# Altium project Flex_Bridge_SW.PrjPcb
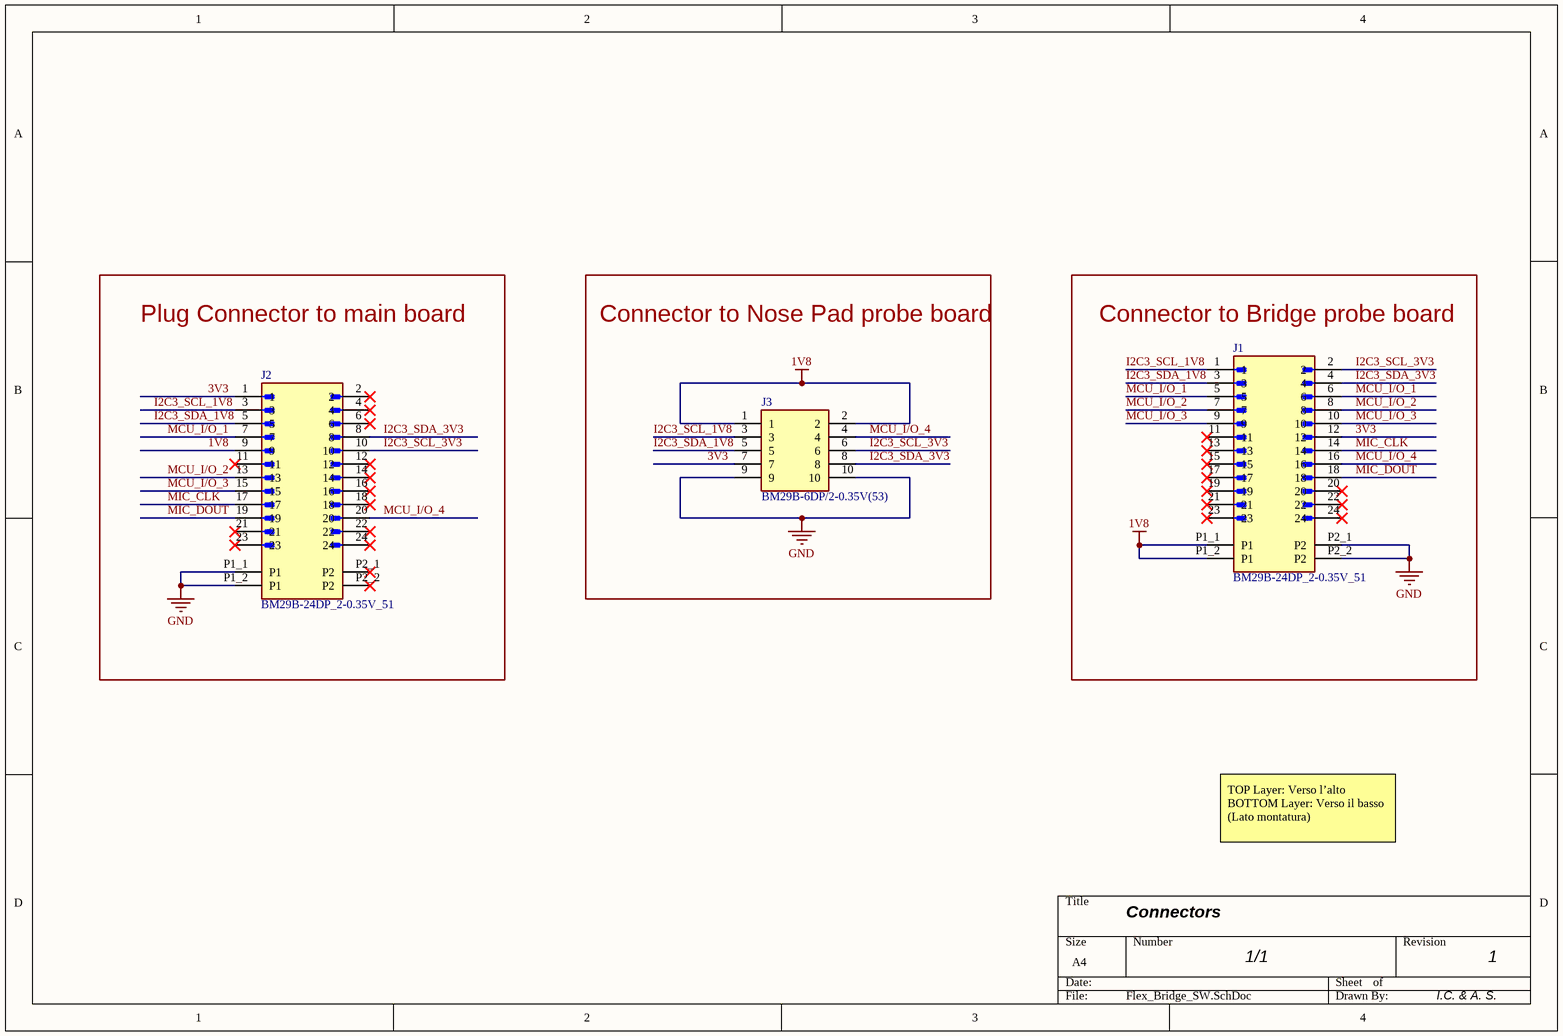
[diagram p0: Flex_Bridge_SW.SchDoc]
1 sheet, 3 parts. Net scope: global (net labels, ports and power ports of the same name join across sheets).
Board files: Flex_Bridge_SW.PcbDoc, Flex_Bridge_SW_panel.PcbDoc

## Sheet Flex_Bridge_SW.SchDoc
size A4; SheetNumber: 1; SheetTotal: 1

### Parts
J1  BM29B-24DP_2-0.35V_51  [New footprint 1]
J2  BM29B-24DP_2-0.35V_51  [New footprint 1]
J3  BM29B-6DP/2-0.35V(53)  [BM29B-6DP_2-0.35V(53)-Footprint-1]

### Blocks framed on the sheet
Plug Connector to main board: J2
Connector to Nose Pad probe board: J3
Connector to Bridge probe board: J1

### Nets
1V8: J1.P1_1(P1) J1.P1_2(P1) J2.9 J3.1 J3.2
GND: J1.P2_1(P2) J1.P2_2(P2) J2.P1_1(P1) J2.P1_2(P1) J3.9 J3.10
3V3: J1.12 J2.1 J3.7
I2C3_SCL_1V8: J1.1 J2.3 J3.3
I2C3_SCL_3V3: J1.2 J2.10 J3.6
I2C3_SDA_1V8: J1.3 J2.5 J3.5
I2C3_SDA_3V3: J1.4 J2.8 J3.8
MCU_I/O_1: J1.5 J1.6 J2.7
MCU_I/O_2: J1.7 J1.8 J2.13
MCU_I/O_3: J1.9 J1.10 J2.15
MCU_I/O_4: J1.16 J2.20 J3.4
MIC_CLK: J1.14 J2.17
MIC_DOUT: J1.18 J2.19

Not connected (* = marked no-connect by the designer): J1 11* 13* 15* 17* 19* 20* 21* 22* 23* 24*; J2 2* 4* 6* 11* 12* 14* 16* 18* 21* 22* 23* 24* P2_1(P2)* P2_2(P2)*

### Notes on the sheet
- TOP Layer: Verso l’alto
  BOTTOM Layer: Verso il basso (Lato montatura)
- Connectors
- 1/1
- 1
- I.C. & A. S.

### Library data of the parts
J1 J2 = CMP-00140-3: Ultra-small, power/signal contact design for Board-to-Board/FPC-to-Board providing 3A max current
J3 = CMP-002-00078-6: Ultra-Small, Power & Signal Hybrid, Board to Board / FPC to Board with 3A Max.